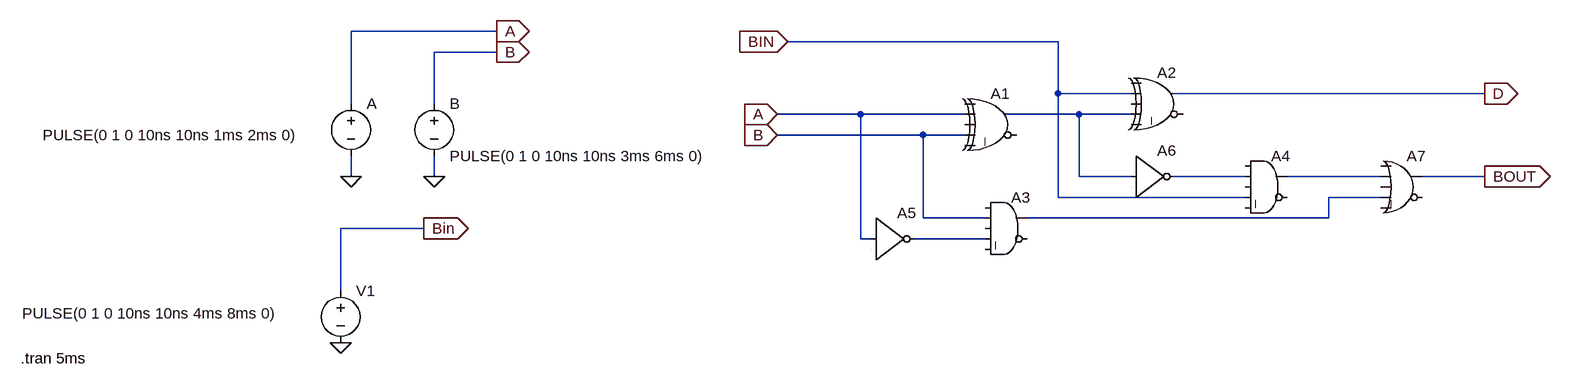
[diagram p0: schematic TP8_Full_Substractor.asc]
TP8_Full_Substractor.asc, the LTspice schematic file:
Version 4
SHEET 1 1748 792
WIRE -160 192 -384 192
WIRE 704 208 288 208
WIRE -160 224 -256 224
WIRE 704 288 704 208
WIRE 816 288 704 288
WIRE 1360 288 880 288
WIRE -384 304 -384 192
WIRE -256 304 -256 224
WIRE 400 320 272 320
WIRE 560 320 400 320
WIRE 736 320 624 320
WIRE 816 320 736 320
WIRE 496 352 272 352
WIRE 560 352 496 352
WIRE -384 416 -384 384
WIRE -256 416 -256 384
WIRE 736 416 736 320
WIRE 816 416 736 416
WIRE 992 416 880 416
WIRE 1200 416 1056 416
WIRE 1360 416 1264 416
WIRE 704 448 704 288
WIRE 992 448 704 448
WIRE 1200 448 1120 448
WIRE 496 480 496 352
WIRE 592 480 496 480
WIRE 1120 480 1120 448
WIRE 1120 480 656 480
WIRE -272 496 -400 496
WIRE 400 512 400 320
WIRE 416 512 400 512
WIRE 592 512 480 512
WIRE -400 592 -400 496
FLAG -384 416 0
FLAG -256 416 0
FLAG -160 192 A
IOPIN -160 192 Out
FLAG -160 224 B
IOPIN -160 224 Out
FLAG -400 672 0
FLAG -272 496 Bin
IOPIN -272 496 Out
FLAG 272 320 A
IOPIN 272 320 In
FLAG 272 352 B
IOPIN 272 352 In
FLAG 1360 288 D
IOPIN 1360 288 Out
FLAG 288 208 BIN
IOPIN 288 208 In
FLAG 1360 416 BOUT
IOPIN 1360 416 Out
SYMBOL voltage -384 288 R0
WINDOW 3 -474 64 Left 2
WINDOW 123 0 0 Left 0
WINDOW 39 0 0 Left 0
SYMATTR Value PULSE(0 1 0 10ns 10ns 1ms 2ms 0)
SYMATTR InstName A
SYMBOL voltage -256 288 R0
WINDOW 123 0 0 Left 0
WINDOW 39 0 0 Left 0
SYMATTR InstName B
SYMATTR Value PULSE(0 1 0 10ns 10ns 3ms 6ms 0)
SYMBOL voltage -400 576 R0
WINDOW 3 -490 51 Left 2
WINDOW 123 0 0 Left 0
WINDOW 39 0 0 Left 0
SYMATTR InstName V1
SYMATTR Value PULSE(0 1 0 10ns 10ns 4ms 8ms 0)
SYMBOL Digital\\xor 608 272 R0
SYMATTR InstName A1
SYMBOL Digital\\xor 864 240 R0
SYMATTR InstName A2
SYMBOL Digital\\and 624 432 R0
SYMATTR InstName A3
SYMBOL Digital\\and 1024 368 R0
SYMATTR InstName A4
SYMBOL Digital\\inv 416 448 R0
SYMATTR InstName A5
SYMBOL Digital\\inv 816 352 R0
SYMATTR InstName A6
SYMBOL Digital\\or 1232 368 R0
SYMATTR InstName A7
TEXT -892 696 Left 2 !.tran 5ms

The netlist it stands for:
* TP8_Full_Substractor.asc
V§A A 0 PULSE(0 1 0 10ns 10ns 1ms 2ms 0)
V§B B 0 PULSE(0 1 0 10ns 10ns 3ms 6ms 0)
V1 Bin 0 PULSE(0 1 0 10ns 10ns 4ms 8ms 0)
A1 0 A 0 B 0 0 N001 0 XOR
A2 0 Bin 0 N001 0 0 D 0 XOR
A3 0 B 0 N005 0 0 N004 0 AND
A4 0 N002 0 Bin 0 0 N003 0 AND
A5 A 0 0 0 0 N005 0 0 BUF
A6 N001 0 0 0 0 N002 0 0 BUF
A7 0 N003 0 N004 0 0 BOUT 0 OR
.tran 5ms
.backanno
.end